# EAGLE schematic N-H-Bridge (EAGLE 8.0.0)
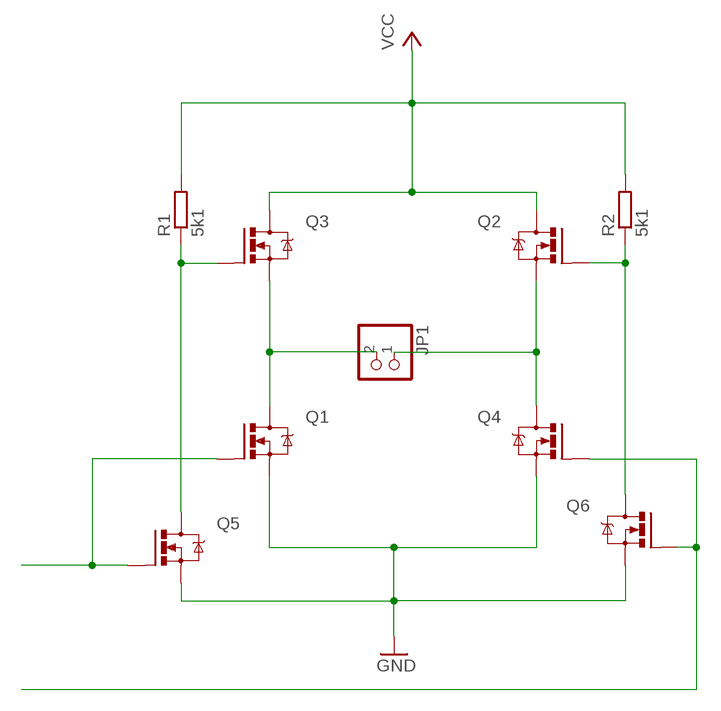
[diagram p0: schematic, sheet 1]

## Parts
JP1  PINHD-1X2  [1X02]
Q1  FET-NPF-2X2  [POWERFLAT-2X2]
Q2  FET-NPF-2X2  [POWERFLAT-2X2]
Q3  FET-NPF-2X2  [POWERFLAT-2X2]
Q4  FET-NPF-2X2  [POWERFLAT-2X2]
Q5  FET-NPF-2X2  [POWERFLAT-2X2]
Q6  FET-NPF-2X2  [POWERFLAT-2X2]
R1  5k1  R_0603  [R0603]
R2  5k1  R_0603  [R0603]

## Nets
GND: Q1.S Q1.S4(S) Q4.S Q4.S4(S) Q5.S Q5.S4(S) Q6.S Q6.S4(S)
N$1: Q3.G3(G) Q5.D Q5.D1(D) Q5.D2(D) Q5.D5(D) Q5.D6(D) R1.1
N$2: Q1.G3(G) Q5.G3(G)
N$3: Q2.G3(G) Q6.D Q6.D1(D) Q6.D2(D) Q6.D5(D) Q6.D6(D) R2.1
N$5: JP1.1 Q2.S Q2.S4(S) Q4.D Q4.D1(D) Q4.D2(D) Q4.D5(D) Q4.D6(D)
N$6: Q4.G3(G) Q6.G3(G)
N$9: JP1.2 Q1.D Q1.D1(D) Q1.D2(D) Q1.D5(D) Q1.D6(D) Q3.S Q3.S4(S)
VCC: Q2.D Q2.D1(D) Q2.D2(D) Q2.D5(D) Q2.D6(D) Q3.D Q3.D1(D) Q3.D2(D) Q3.D5(D) Q3.D6(D) R1.2 R2.2

## Library data of the parts
JP1 = pinhead:PINHD-1X2: PIN HEADER
Q1-Q6 = Namenlos:FET-N
R1 R2 = Namenlos:R_